# Altium schematic sheet A_out_DigiPidCntlr.SchDoc
size A4
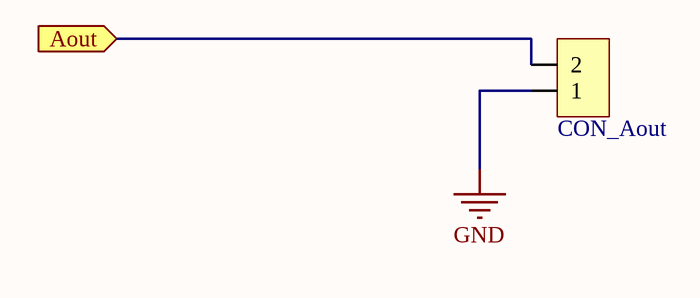
[diagram p0: A_out_DigiPidCntlr.SchDoc]

## Parts
CON_Aout  screw term 2 pin, 5.08mm  [MKDSN 1,5/ 2-5,08]  (value not drawn)

## Ports
Aout (in)

## Nets
GND: CON_Aout.1
Aout: CON_Aout.2 ; port Aout

## Library data of the parts
CON_Aout = 2_pin_5.08mm